# Altium schematic sheet 1_P1.schdoc
size 309 x 223 mm; Symbol: Sheet-Symbol_A4; Device: Sheet-Symbol_A4; @Page Name: P1; @Create Date: 2023-03-31; @Page Count: 1; @Page No: 1; @Project Name: FDC2214-Plates; @Schematic Name: Schematic1; @Update Date: 2023-03-31; Company: 嘉立创EDA; Page Size: A4; Version: V1.0
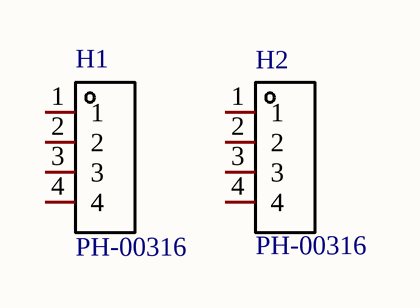
[diagram p0: 1_P1.schdoc]

## Parts
H1  PH-00316  [HDR-TH_4P-P2.54-V-M]
H2  PH-00316  [HDR-TH_4P-P2.54-V-M]

## Nets

Not connected (* = marked no-connect by the designer): H1 1 2 3 4; H2 1 2 3 4

## Notes on the sheet
- 1
- 2
- 3
- 4
- 5
- 6
- A
- B
- C
- Schematic
- Schematic1
- Create Date
- Update Date
- 2023-03-31
- Reviewed
- Drawed
- Page
- P1
- Part Number
- FDC2214-Plates
- D
- VER
- SIZE
- PAGE
- OF
- V1.0
- A4
- 嘉立创EDA

## Library data of the parts
H1 H2 = PH-00316: 排数:单排;总PIN位数:4;间距:2.54mm;插针结构:1x4P;行距:-;安装类型:直插;圆针/方针:方针;额定电流:3A;额定电压:-;配合针长度:6mm;塑高:2.5mm;端接针长度:3mm;触头材质:-;工作温度范围:-40℃~+105℃;颜色:黑色;; Manufacturer: Liansheng(连盛); Add into BOM: yes; Pitch: 2.54mm; Pin Structure: 1x4P; Circluar Pins/Square Pins: 方针; Current Rating (Max): 3A; Name: PH-00316; Symbol: PH-00316; Device: PH-00316; LCSC Part Name: 2.54mm 1x4P 直插 方针; Supplier Part: C2829876; Manufacturer Part: PH-00316; Supplier Footprint: 插件,P=2.54mm; JLCPCB Part Class: 扩展库; Datasheet: https://atta.szlcsc.com/upload/public/pdf/source/20210507/C2829876_F20B84CA126BE646AD6D3B37A7F8807A.pdf; Supplier: LCSC; Convert to PCB: yes; Number of Rows: 单排; Number of Pins: 4; Row Spacing: -; Mounting Type: 直插; Voltage Rating (Max): -; Length of Mating Pin: 6mm; Insulation Height: 2.5mm; Length of End Connection Pin: 3mm; Contact Material: -; Operating Temperature Range: -40℃~+105℃; Color: 黑色